# Altium schematic sheet QDC.SchDoc
size A3; SheetNumber: 15; SheetTotal: 33
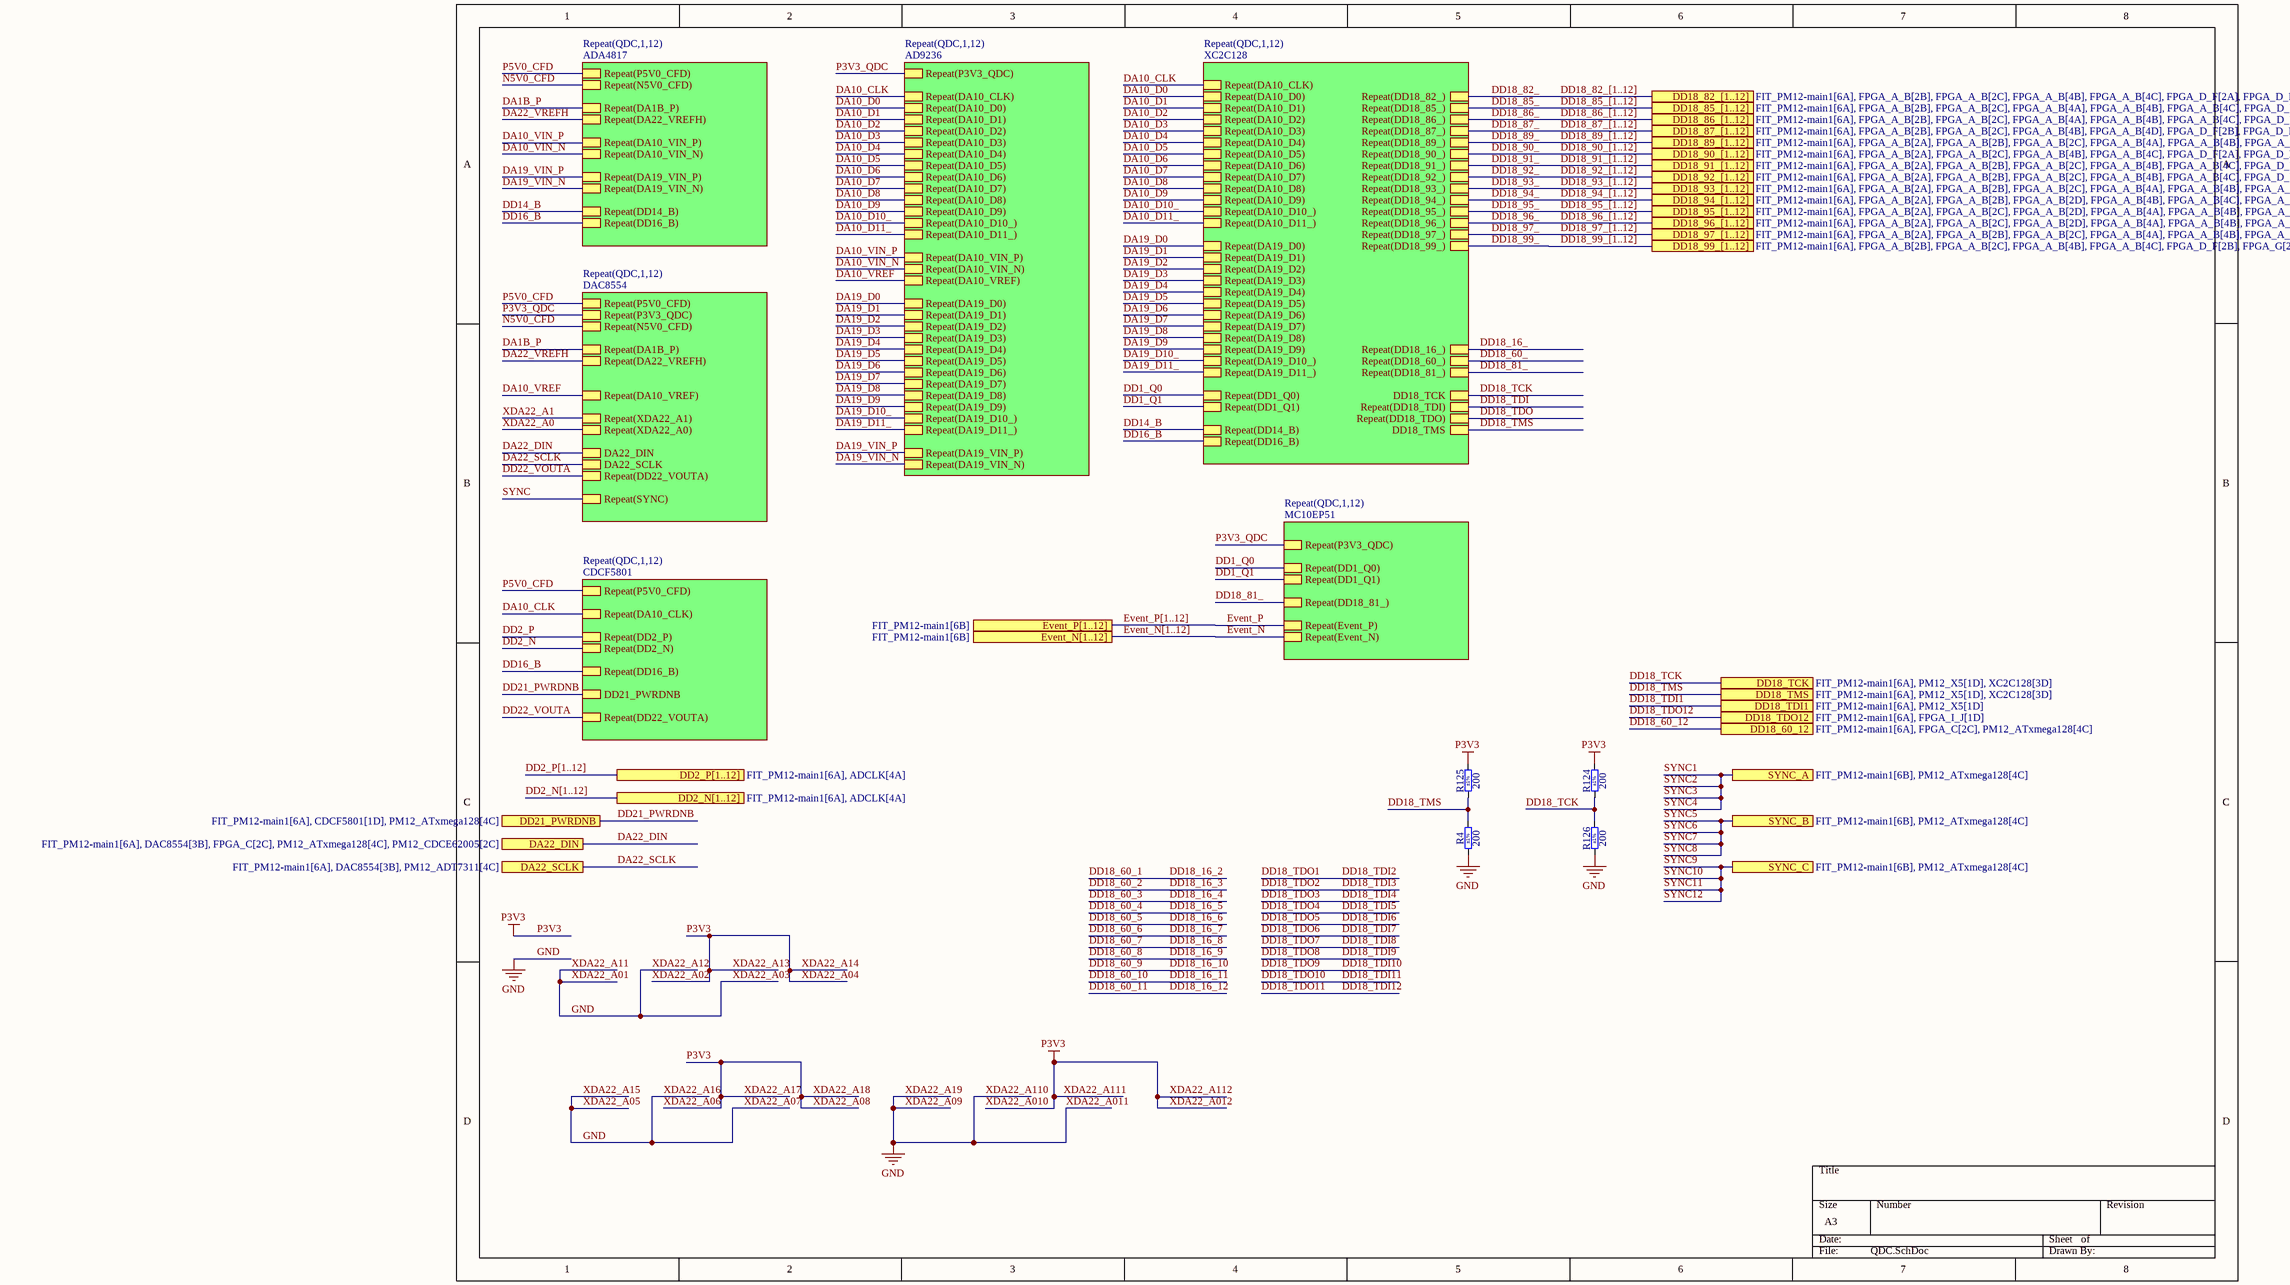
[diagram p0: QDC.SchDoc]

## Parts
R4  200  Tolerance: ±1%  [RESC2012X60N]
R124  200  Tolerance: ±1%  [RESC2012X60N]
R125  200  Tolerance: ±1%  [RESC2012X60N]
R126  200  Tolerance: ±1%  [RESC2012X60N]

## Sub-sheets
Repeat(QDC,1,12) = ADA4817: Repeat(N5V0_CFD), Repeat(P5V0_CFD), Repeat(DD14_B), Repeat(DD16_B), Repeat(DA22_VREFH), Repeat(DA10_VIN_N), Repeat(DA19_VIN_P), Repeat(DA19_VIN_N), Repeat(DA1B_P), Repeat(DA10_VIN_P)
Repeat(QDC,1,12) = AD9236: Repeat(P3V3_QDC), Repeat(DA10_VIN_N), Repeat(DA10_VIN_P), Repeat(DA19_VIN_P), Repeat(DA19_VIN_N), Repeat(DA10_VREF), Repeat(DA10_CLK), Repeat(DA19_D11_), Repeat(DA19_D10_), Repeat(DA19_D9), Repeat(DA19_D8), Repeat(DA19_D0), Repeat(DA19_D1), Repeat(DA19_D2), Repeat(DA19_D3), Repeat(DA19_D4), Repeat(DA19_D5), Repeat(DA19_D6), Repeat(DA19_D7), Repeat(DA10_D6), Repeat(DA10_D5), Repeat(DA10_D4), Repeat(DA10_D3), Repeat(DA10_D2), Repeat(DA10_D1), Repeat(DA10_D0), Repeat(DA10_D8), Repeat(DA10_D7), Repeat(DA10_D10_), Repeat(DA10_D9), Repeat(DA10_D11_)
Repeat(QDC,1,12) = XC2C128: Repeat(DD14_B), Repeat(DD16_B), Repeat(DA10_CLK), Repeat(DD18_81_), Repeat(DD1_Q1), Repeat(DD1_Q0), Repeat(DD18_TDI), Repeat(DD18_99_), Repeat(DD18_97_), Repeat(DD18_96_), Repeat(DD18_95_), Repeat(DD18_94_), Repeat(DD18_93_), Repeat(DD18_92_), Repeat(DD18_91_), Repeat(DD18_90_), Repeat(DD18_82_), Repeat(DD18_85_), Repeat(DD18_86_), Repeat(DD18_87_), Repeat(DD18_89_), Repeat(DA10_D6), Repeat(DA10_D5), Repeat(DA10_D4), Repeat(DA10_D3), Repeat(DA10_D2), Repeat(DA10_D1), Repeat(DA10_D0), Repeat(DA19_D11_), Repeat(DA19_D10_), Repeat(DA19_D9), Repeat(DA19_D8), Repeat(DA10_D8), Repeat(DA10_D7), Repeat(DA10_D10_), Repeat(DA10_D9), Repeat(DD18_16_), Repeat(DA10_D11_), Repeat(DA19_D0), Repeat(DA19_D1), Repeat(DA19_D2), Repeat(DA19_D3), Repeat(DA19_D4), Repeat(DA19_D5), Repeat(DA19_D6), Repeat(DA19_D7), Repeat(DD18_60_), Repeat(DD18_TDO), DD18_TCK, DD18_TMS
Repeat(QDC,1,12) = DAC8554: Repeat(DD22_VOUTA), DA22_DIN, DA22_SCLK, Repeat(SYNC), Repeat(P5V0_CFD), Repeat(N5V0_CFD), Repeat(P3V3_QDC), Repeat(DA22_VREFH), Repeat(DA1B_P), Repeat(DA10_VREF), Repeat(XDA22_A1), Repeat(XDA22_A0)
Repeat(QDC,1,12) = CDCF5801: Repeat(DD2_P), Repeat(DD2_N), DD21_PWRDNB, Repeat(DD22_VOUTA), Repeat(P5V0_CFD), Repeat(DA10_CLK), Repeat(DD16_B)
Repeat(QDC,1,12) = MC10EP51: Repeat(DD18_81_), Repeat(Event_P), Repeat(Event_N), Repeat(P3V3_QDC), Repeat(DD1_Q1), Repeat(DD1_Q0)

## Ports
DA22_DIN (see FIT_PM12-main1[6A], DAC8554[3B], FPGA_C[2C], PM12_ATxmega128[4C], PM12_CDCE62005[2C]), DA22_SCLK (see FIT_PM12-main1[6A], DAC8554[3B], PM12_ADT7311[4C]), DD2_N[1..12] (see FIT_PM12-main1[6A], ADCLK[4A]), DD2_P[1..12] (see FIT_PM12-main1[6A], ADCLK[4A]), DD18_60_12 (see FIT_PM12-main1[6A], FPGA_C[2C], PM12_ATxmega128[4C]), DD18_82_[1..12] (see FIT_PM12-main1[6A], FPGA_A_B[2B], FPGA_A_B[2C], FPGA_A_B[4B], FPGA_A_B[4C], FPGA_D_F[2A], FPGA_D_F[2B], FPGA_D_F[2D], FPGA_G[2B], FPGA_H[2A]), DD18_85_[1..12] (see FIT_PM12-main1[6A], FPGA_A_B[2B], FPGA_A_B[2C], FPGA_A_B[4A], FPGA_A_B[4B], FPGA_A_B[4C], FPGA_D_F[2A], FPGA_D_F[2B], FPGA_D_F[2D], FPGA_G[2A], FPGA_H[2A]), DD18_86_[1..12] (see FIT_PM12-main1[6A], FPGA_A_B[2B], FPGA_A_B[2C], FPGA_A_B[4A], FPGA_A_B[4B], FPGA_A_B[4C], FPGA_D_F[2A], FPGA_D_F[2B], FPGA_D_F[2D], FPGA_G[2A], FPGA_H[2B]), DD18_87_[1..12] (see FIT_PM12-main1[6A], FPGA_A_B[2B], FPGA_A_B[2C], FPGA_A_B[4B], FPGA_A_B[4D], FPGA_D_F[2B], FPGA_D_F[2D], FPGA_G[2A], FPGA_H[2B]), DD18_89_[1..12] (see FIT_PM12-main1[6A], FPGA_A_B[2A], FPGA_A_B[2B], FPGA_A_B[2C], FPGA_A_B[4A], FPGA_A_B[4B], FPGA_A_B[4C], FPGA_D_F[2B], FPGA_D_F[2D], FPGA_G[2A], FPGA_H[2B]), DD18_90_[1..12] (see FIT_PM12-main1[6A], FPGA_A_B[2A], FPGA_A_B[2C], FPGA_A_B[4B], FPGA_A_B[4C], FPGA_D_F[2A], FPGA_D_F[2B], FPGA_D_F[2D], FPGA_G[2A], FPGA_H[2A]), DD18_91_[1..12] (see FIT_PM12-main1[6A], FPGA_A_B[2A], FPGA_A_B[2B], FPGA_A_B[2C], FPGA_A_B[4B], FPGA_A_B[4C], FPGA_D_F[2B], FPGA_D_F[2D], FPGA_G[2C], FPGA_H[2A], FPGA_H[2C]), DD18_92_[1..12] (see FIT_PM12-main1[6A], FPGA_A_B[2A], FPGA_A_B[2B], FPGA_A_B[2C], FPGA_A_B[4B], FPGA_A_B[4C], FPGA_D_F[2B], FPGA_D_F[2D], FPGA_G[2C], FPGA_H[2A], FPGA_H[2C]), DD18_93_[1..12] (see FIT_PM12-main1[6A], FPGA_A_B[2A], FPGA_A_B[2B], FPGA_A_B[2C], FPGA_A_B[4A], FPGA_A_B[4B], FPGA_A_B[4C], FPGA_D_F[2A], FPGA_D_F[2D], FPGA_G[2C], FPGA_H[2A], FPGA_H[2C]), DD18_94_[1..12] (see FIT_PM12-main1[6A], FPGA_A_B[2A], FPGA_A_B[2B], FPGA_A_B[2D], FPGA_A_B[4B], FPGA_A_B[4C], FPGA_A_B[4D], FPGA_D_F[2A], FPGA_D_F[2D], FPGA_G[2C], FPGA_H[2A], FPGA_H[2C]), DD18_95_[1..12] (see FIT_PM12-main1[6A], FPGA_A_B[2A], FPGA_A_B[2C], FPGA_A_B[2D], FPGA_A_B[4A], FPGA_A_B[4B], FPGA_A_B[4C], FPGA_D_F[2B], FPGA_G[2C], FPGA_H[2A], FPGA_H[2C]), DD18_96_[1..12] (see FIT_PM12-main1[6A], FPGA_A_B[2A], FPGA_A_B[2C], FPGA_A_B[2D], FPGA_A_B[4A], FPGA_A_B[4B], FPGA_A_B[4C], FPGA_D_F[2B], FPGA_G[2C], FPGA_H[2A], FPGA_H[2C]), DD18_97_[1..12] (see FIT_PM12-main1[6A], FPGA_A_B[2A], FPGA_A_B[2B], FPGA_A_B[2C], FPGA_A_B[4A], FPGA_A_B[4B], FPGA_A_B[4C], FPGA_D_F[2A], FPGA_D_F[2B], FPGA_G[2C], FPGA_H[2A], FPGA_H[2C]), DD18_99_[1..12] (see FIT_PM12-main1[6A], FPGA_A_B[2B], FPGA_A_B[2C], FPGA_A_B[4B], FPGA_A_B[4C], FPGA_D_F[2B], FPGA_G[2B], FPGA_H[2C]), DD18_TCK (see FIT_PM12-main1[6A], PM12_X5[1D], XC2C128[3D]), DD18_TDI1 (see FIT_PM12-main1[6A], PM12_X5[1D]), DD18_TDO12 (see FIT_PM12-main1[6A], FPGA_I_J[1D]), DD18_TMS (see FIT_PM12-main1[6A], PM12_X5[1D], XC2C128[3D]), DD21_PWRDNB (see FIT_PM12-main1[6A], CDCF5801[1D], PM12_ATxmega128[4C]), Event_N[1..12] (see FIT_PM12-main1[6B]), Event_P[1..12] (see FIT_PM12-main1[6B]), SYNC_A (see FIT_PM12-main1[6B], PM12_ATxmega128[4C]), SYNC_B (see FIT_PM12-main1[6B], PM12_ATxmega128[4C]), SYNC_C (see FIT_PM12-main1[6B], PM12_ATxmega128[4C])

## Nets
GND: R4.1 R126.1  [also labelled XDA22_A01, XDA22_A011, XDA22_A03, XDA22_A05, XDA22_A07, XDA22_A09, XDA22_A11, XDA22_A110, XDA22_A12, XDA22_A15, XDA22_A16, XDA22_A19]
P3V3: R124.2 R125.2  [also labelled XDA22_A010, XDA22_A012, XDA22_A02, XDA22_A04, XDA22_A06, XDA22_A08, XDA22_A111, XDA22_A112, XDA22_A13, XDA22_A14, XDA22_A17, XDA22_A18]
DA1B_P: sheet Repeat(QDC,1,12)/Repeat(DA1B_P), sheet Repeat(QDC,1,12)/Repeat(DA1B_P)
DA10_CLK: sheet Repeat(QDC,1,12)/Repeat(DA10_CLK), sheet Repeat(QDC,1,12)/Repeat(DA10_CLK), sheet Repeat(QDC,1,12)/Repeat(DA10_CLK)
DA10_D0: sheet Repeat(QDC,1,12)/Repeat(DA10_D0), sheet Repeat(QDC,1,12)/Repeat(DA10_D0)
DA10_D1: sheet Repeat(QDC,1,12)/Repeat(DA10_D1), sheet Repeat(QDC,1,12)/Repeat(DA10_D1)
DA10_D2: sheet Repeat(QDC,1,12)/Repeat(DA10_D2), sheet Repeat(QDC,1,12)/Repeat(DA10_D2)
DA10_D3: sheet Repeat(QDC,1,12)/Repeat(DA10_D3), sheet Repeat(QDC,1,12)/Repeat(DA10_D3)
DA10_D4: sheet Repeat(QDC,1,12)/Repeat(DA10_D4), sheet Repeat(QDC,1,12)/Repeat(DA10_D4)
DA10_D5: sheet Repeat(QDC,1,12)/Repeat(DA10_D5), sheet Repeat(QDC,1,12)/Repeat(DA10_D5)
DA10_D6: sheet Repeat(QDC,1,12)/Repeat(DA10_D6), sheet Repeat(QDC,1,12)/Repeat(DA10_D6)
DA10_D7: sheet Repeat(QDC,1,12)/Repeat(DA10_D7), sheet Repeat(QDC,1,12)/Repeat(DA10_D7)
DA10_D8: sheet Repeat(QDC,1,12)/Repeat(DA10_D8), sheet Repeat(QDC,1,12)/Repeat(DA10_D8)
DA10_D9: sheet Repeat(QDC,1,12)/Repeat(DA10_D9), sheet Repeat(QDC,1,12)/Repeat(DA10_D9)
DA10_D10_: sheet Repeat(QDC,1,12)/Repeat(DA10_D10_), sheet Repeat(QDC,1,12)/Repeat(DA10_D10_)
DA10_D11_: sheet Repeat(QDC,1,12)/Repeat(DA10_D11_), sheet Repeat(QDC,1,12)/Repeat(DA10_D11_)
DA10_VIN_N: sheet Repeat(QDC,1,12)/Repeat(DA10_VIN_N), sheet Repeat(QDC,1,12)/Repeat(DA10_VIN_N)
DA10_VIN_P: sheet Repeat(QDC,1,12)/Repeat(DA10_VIN_P), sheet Repeat(QDC,1,12)/Repeat(DA10_VIN_P)
DA10_VREF: sheet Repeat(QDC,1,12)/Repeat(DA10_VREF), sheet Repeat(QDC,1,12)/Repeat(DA10_VREF)
DA19_D0: sheet Repeat(QDC,1,12)/Repeat(DA19_D0), sheet Repeat(QDC,1,12)/Repeat(DA19_D0)
DA19_D1: sheet Repeat(QDC,1,12)/Repeat(DA19_D1), sheet Repeat(QDC,1,12)/Repeat(DA19_D1)
DA19_D2: sheet Repeat(QDC,1,12)/Repeat(DA19_D2), sheet Repeat(QDC,1,12)/Repeat(DA19_D2)
DA19_D3: sheet Repeat(QDC,1,12)/Repeat(DA19_D3), sheet Repeat(QDC,1,12)/Repeat(DA19_D3)
DA19_D4: sheet Repeat(QDC,1,12)/Repeat(DA19_D4), sheet Repeat(QDC,1,12)/Repeat(DA19_D4)
DA19_D5: sheet Repeat(QDC,1,12)/Repeat(DA19_D5), sheet Repeat(QDC,1,12)/Repeat(DA19_D5)
DA19_D6: sheet Repeat(QDC,1,12)/Repeat(DA19_D6), sheet Repeat(QDC,1,12)/Repeat(DA19_D6)
DA19_D7: sheet Repeat(QDC,1,12)/Repeat(DA19_D7), sheet Repeat(QDC,1,12)/Repeat(DA19_D7)
DA19_D8: sheet Repeat(QDC,1,12)/Repeat(DA19_D8), sheet Repeat(QDC,1,12)/Repeat(DA19_D8)
DA19_D9: sheet Repeat(QDC,1,12)/Repeat(DA19_D9), sheet Repeat(QDC,1,12)/Repeat(DA19_D9)
DA19_D10_: sheet Repeat(QDC,1,12)/Repeat(DA19_D10_), sheet Repeat(QDC,1,12)/Repeat(DA19_D10_)
DA19_D11_: sheet Repeat(QDC,1,12)/Repeat(DA19_D11_), sheet Repeat(QDC,1,12)/Repeat(DA19_D11_)
DA19_VIN_N: sheet Repeat(QDC,1,12)/Repeat(DA19_VIN_N), sheet Repeat(QDC,1,12)/Repeat(DA19_VIN_N)
DA19_VIN_P: sheet Repeat(QDC,1,12)/Repeat(DA19_VIN_P), sheet Repeat(QDC,1,12)/Repeat(DA19_VIN_P)
DA22_DIN: port DA22_DIN, sheet Repeat(QDC,1,12)/DA22_DIN
DA22_SCLK: port DA22_SCLK, sheet Repeat(QDC,1,12)/DA22_SCLK
DA22_VREFH: sheet Repeat(QDC,1,12)/Repeat(DA22_VREFH), sheet Repeat(QDC,1,12)/Repeat(DA22_VREFH)
DD1_Q0: sheet Repeat(QDC,1,12)/Repeat(DD1_Q0), sheet Repeat(QDC,1,12)/Repeat(DD1_Q0)
DD1_Q1: sheet Repeat(QDC,1,12)/Repeat(DD1_Q1), sheet Repeat(QDC,1,12)/Repeat(DD1_Q1)
DD2_N: sheet Repeat(QDC,1,12)/Repeat(DD2_N)
DD2_P: sheet Repeat(QDC,1,12)/Repeat(DD2_P)
DD14_B: sheet Repeat(QDC,1,12)/Repeat(DD14_B), sheet Repeat(QDC,1,12)/Repeat(DD14_B)
DD16_B: sheet Repeat(QDC,1,12)/Repeat(DD16_B), sheet Repeat(QDC,1,12)/Repeat(DD16_B), sheet Repeat(QDC,1,12)/Repeat(DD16_B)
DD18_16_: sheet Repeat(QDC,1,12)/Repeat(DD18_16_)
DD18_60_: sheet Repeat(QDC,1,12)/Repeat(DD18_60_)
DD18_60_12: port DD18_60_12
DD18_81_: sheet Repeat(QDC,1,12)/Repeat(DD18_81_), sheet Repeat(QDC,1,12)/Repeat(DD18_81_)
DD18_82_: sheet Repeat(QDC,1,12)/Repeat(DD18_82_)
DD18_85_: sheet Repeat(QDC,1,12)/Repeat(DD18_85_)
DD18_86_: sheet Repeat(QDC,1,12)/Repeat(DD18_86_)
DD18_87_: sheet Repeat(QDC,1,12)/Repeat(DD18_87_)
DD18_89_: sheet Repeat(QDC,1,12)/Repeat(DD18_89_)
DD18_90_: sheet Repeat(QDC,1,12)/Repeat(DD18_90_)
DD18_91_: sheet Repeat(QDC,1,12)/Repeat(DD18_91_)
DD18_92_: sheet Repeat(QDC,1,12)/Repeat(DD18_92_)
DD18_93_: sheet Repeat(QDC,1,12)/Repeat(DD18_93_)
DD18_94_: sheet Repeat(QDC,1,12)/Repeat(DD18_94_)
DD18_95_: sheet Repeat(QDC,1,12)/Repeat(DD18_95_)
DD18_96_: sheet Repeat(QDC,1,12)/Repeat(DD18_96_)
DD18_97_: sheet Repeat(QDC,1,12)/Repeat(DD18_97_)
DD18_99_: sheet Repeat(QDC,1,12)/Repeat(DD18_99_)
DD18_TCK: R124.1 R126.2 ; port DD18_TCK, sheet Repeat(QDC,1,12)/DD18_TCK
DD18_TDI: sheet Repeat(QDC,1,12)/Repeat(DD18_TDI)
DD18_TDI1: port DD18_TDI1
DD18_TDO: sheet Repeat(QDC,1,12)/Repeat(DD18_TDO)
DD18_TDO12: port DD18_TDO12
DD18_TMS: R4.2 R125.1 ; port DD18_TMS, sheet Repeat(QDC,1,12)/DD18_TMS
DD21_PWRDNB: port DD21_PWRDNB, sheet Repeat(QDC,1,12)/DD21_PWRDNB
DD22_VOUTA: sheet Repeat(QDC,1,12)/Repeat(DD22_VOUTA), sheet Repeat(QDC,1,12)/Repeat(DD22_VOUTA)
Event_N: sheet Repeat(QDC,1,12)/Repeat(Event_N)
Event_P: sheet Repeat(QDC,1,12)/Repeat(Event_P)
N5V0_CFD: sheet Repeat(QDC,1,12)/Repeat(N5V0_CFD), sheet Repeat(QDC,1,12)/Repeat(N5V0_CFD)
P3V3_QDC: sheet Repeat(QDC,1,12)/Repeat(P3V3_QDC), sheet Repeat(QDC,1,12)/Repeat(P3V3_QDC), sheet Repeat(QDC,1,12)/Repeat(P3V3_QDC)
P5V0_CFD: sheet Repeat(QDC,1,12)/Repeat(P5V0_CFD), sheet Repeat(QDC,1,12)/Repeat(P5V0_CFD), sheet Repeat(QDC,1,12)/Repeat(P5V0_CFD)
SYNC: sheet Repeat(QDC,1,12)/Repeat(SYNC)
SYNC1: port SYNC_A  [also labelled SYNC2, SYNC3, SYNC4]
SYNC5: port SYNC_B  [also labelled SYNC6, SYNC7, SYNC8]
SYNC10: port SYNC_C  [also labelled SYNC11, SYNC12, SYNC9]
XDA22_A0: sheet Repeat(QDC,1,12)/Repeat(XDA22_A0)
XDA22_A1: sheet Repeat(QDC,1,12)/Repeat(XDA22_A1)

## Buses and harness runs
bus DD2_N[1..12] = port DD2_N[1..12]
bus DD2_P[1..12] = port DD2_P[1..12]
bus DD18_82_[1..12] = port DD18_82_[1..12]
bus DD18_85_[1..12] = port DD18_85_[1..12]
bus DD18_86_[1..12] = port DD18_86_[1..12]
bus DD18_87_[1..12] = port DD18_87_[1..12]
bus DD18_89_[1..12] = port DD18_89_[1..12]
bus DD18_90_[1..12] = port DD18_90_[1..12]
bus DD18_91_[1..12] = port DD18_91_[1..12]
bus DD18_92_[1..12] = port DD18_92_[1..12]
bus DD18_93_[1..12] = port DD18_93_[1..12]
bus DD18_94_[1..12] = port DD18_94_[1..12]
bus DD18_95_[1..12] = port DD18_95_[1..12]
bus DD18_96_[1..12] = port DD18_96_[1..12]
bus DD18_97_[1..12] = port DD18_97_[1..12]
bus DD18_99_[1..12] = port DD18_99_[1..12]
bus Event_N[1..12] = port Event_N[1..12]
bus Event_P[1..12] = port Event_P[1..12]

## Library data of the parts
R4 R124-R126 = R0805_200R_1%_0.125W_100PPM: Resistor - 1%; Part Description: General Purpose Thick Film Chip Resistor; Manufacturer: GENERIC; Manufacturer1 Part Number: NRC10F2000TRF; Power: 0.125W; TC: ±100ppm/°C; PressFit: No; Part Number: R0805_200R_1%_0.125W_100PPM; Component Kind: Standard; Component Type: Standard; Pin Count: 2; Value: 200; Status: Preferred; Manufacturer Part Number: R0805_200R_1%_0.125W_100PPM; Case: 0805; Mounted: Yes; Sense: No; Socket: No; SMD: Yes; Manufacturer1 Example: NIC COMPONENT; Manufacturer1 ComponentHeight: 0.6mm; HelpURL: \\cern.ch\dfs\Applications\Altium\Datasheets\R0805_NIC_NRC.pdf; Author: CERN DEM JLC; CreateDate: 03.12.2007; LatestRevisionDate: 13.03.2008